# Altium project PCB_Project.PrjPcb
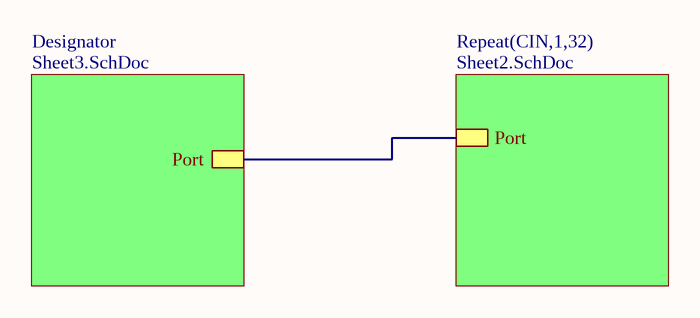
[diagram p0: Sheet1.SchDoc]
3 sheets, 32 parts. Net scope: hierarchical (ports join the sheet entries above them; power ports are global).
Board file: PCB1.PcbDoc
Sheets:
  Sheet1.SchDoc
    CIN1 = Sheet2.SchDoc
    CIN2 = Sheet2.SchDoc
    CIN3 = Sheet2.SchDoc
    CIN4 = Sheet2.SchDoc
    CIN5 = Sheet2.SchDoc
    CIN6 = Sheet2.SchDoc
    CIN7 = Sheet2.SchDoc
    CIN8 = Sheet2.SchDoc
    CIN9 = Sheet2.SchDoc
    CIN10 = Sheet2.SchDoc
    CIN11 = Sheet2.SchDoc
    CIN12 = Sheet2.SchDoc
    CIN13 = Sheet2.SchDoc
    CIN14 = Sheet2.SchDoc
    CIN15 = Sheet2.SchDoc
    CIN16 = Sheet2.SchDoc
    CIN17 = Sheet2.SchDoc
    CIN18 = Sheet2.SchDoc
    CIN19 = Sheet2.SchDoc
    CIN20 = Sheet2.SchDoc
    CIN21 = Sheet2.SchDoc
    CIN22 = Sheet2.SchDoc
    CIN23 = Sheet2.SchDoc
    CIN24 = Sheet2.SchDoc
    CIN25 = Sheet2.SchDoc
    CIN26 = Sheet2.SchDoc
    CIN27 = Sheet2.SchDoc
    CIN28 = Sheet2.SchDoc
    CIN29 = Sheet2.SchDoc
    CIN30 = Sheet2.SchDoc
    CIN31 = Sheet2.SchDoc
    CIN32 = Sheet2.SchDoc
    Designator = Sheet3.SchDoc

## Sheet Sheet1.SchDoc
size A4; SheetNumber: 1; SheetTotal: 3

### Sub-sheets
Designator = Sheet3.SchDoc: Port
Repeat(CIN,1,32) = Sheet2.SchDoc: Port

### Nets
(unnamed): sheet Repeat(CIN,1,32)/Port, sheet Designator/Port

## Sheet Sheet2.SchDoc
size A4; SheetNumber: 2; SheetTotal: 3
Used 32 times, as channels CIN1, CIN2, CIN3, CIN4, CIN5, CIN6, CIN7, CIN8, CIN9, CIN10, CIN11, CIN12, CIN13, CIN14, CIN15, CIN16, CIN17, CIN18, CIN19, CIN20, CIN21, CIN22, CIN23, CIN24, CIN25, CIN26, CIN27, CIN28, CIN29, CIN30, CIN31, CIN32. Parts and nets are listed once, with the designators drawn on the sheet.
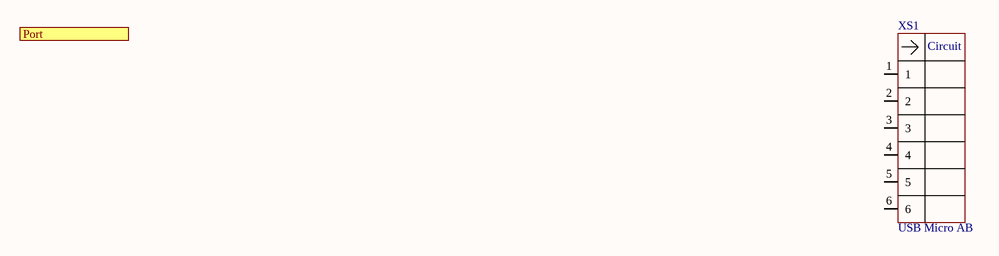
[diagram p1: Sheet2.SchDoc]

### Parts
XS1  USB Micro AB  [USB Micro AB]

### Ports
Port

### Nets

Not connected (* = marked no-connect by the designer): XS1 1 2 3 4 5 6

### Channels
CIN1: designators end in _CIN1; ports Port=open
CIN2: designators end in _CIN2; ports Port=open
CIN3: designators end in _CIN3; ports Port=open
CIN4: designators end in _CIN4; ports Port=open
CIN5: designators end in _CIN5; ports Port=open
CIN6: designators end in _CIN6; ports Port=open
CIN7: designators end in _CIN7; ports Port=open
CIN8: designators end in _CIN8; ports Port=open
CIN9: designators end in _CIN9; ports Port=open
CIN10: designators end in _CIN10; ports Port=open
CIN11: designators end in _CIN11; ports Port=open
CIN12: designators end in _CIN12; ports Port=open
CIN13: designators end in _CIN13; ports Port=open
CIN14: designators end in _CIN14; ports Port=open
CIN15: designators end in _CIN15; ports Port=open
CIN16: designators end in _CIN16; ports Port=open
CIN17: designators end in _CIN17; ports Port=open
CIN18: designators end in _CIN18; ports Port=open
CIN19: designators end in _CIN19; ports Port=open
CIN20: designators end in _CIN20; ports Port=open
CIN21: designators end in _CIN21; ports Port=open
CIN22: designators end in _CIN22; ports Port=open
CIN23: designators end in _CIN23; ports Port=open
CIN24: designators end in _CIN24; ports Port=open
CIN25: designators end in _CIN25; ports Port=open
CIN26: designators end in _CIN26; ports Port=open
CIN27: designators end in _CIN27; ports Port=open
CIN28: designators end in _CIN28; ports Port=open
CIN29: designators end in _CIN29; ports Port=open
CIN30: designators end in _CIN30; ports Port=open
CIN31: designators end in _CIN31; ports Port=open
CIN32: designators end in _CIN32; ports Port=open

### Notes on the sheet
- (in symbol USB Micro AB) Circuit

### Library data of the parts
XS1 = USB Micro AB: Part Number: USB Micro AB; HelpURL: https://www.hirose.co.jp/cataloge_hp/ed_ZX_20140804.pdf

## Sheet Sheet3.SchDoc
size A4; SheetNumber: 3; SheetTotal: 3
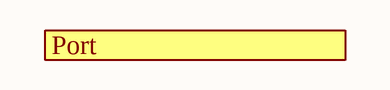
[diagram p2: Sheet3.SchDoc]

### Ports
Port